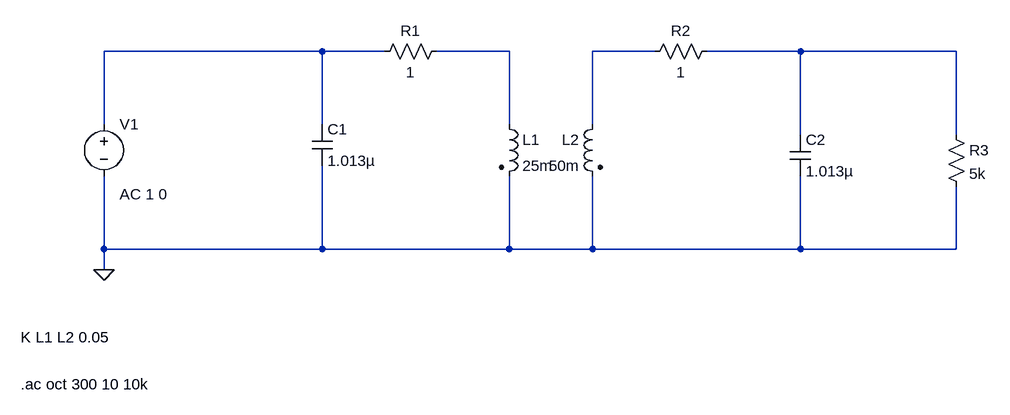
[diagram p0: schematic syncronous_freq.asc]
syncronous_freq.asc, the LTspice schematic file:
Version 4.1
SHEET 1 904 680
WIRE -128 16 -464 16
WIRE -32 16 -128 16
WIRE 160 16 48 16
WIRE 384 16 288 16
WIRE 608 16 464 16
WIRE 848 16 608 16
WIRE -464 128 -464 16
WIRE -128 128 -128 16
WIRE 160 128 160 16
WIRE 288 128 288 16
WIRE 608 144 608 16
WIRE 848 144 848 16
WIRE -464 320 -464 208
WIRE -128 320 -128 192
WIRE -128 320 -464 320
WIRE 160 320 160 208
WIRE 160 320 -128 320
WIRE 288 320 288 208
WIRE 288 320 160 320
WIRE 608 320 608 208
WIRE 608 320 288 320
WIRE 848 320 848 224
WIRE 848 320 608 320
WIRE -464 352 -464 320
FLAG -464 352 0
SYMBOL ind2 144 112 R0
SYMATTR InstName L1
SYMATTR Value 25m
SYMATTR SpiceLine Rser=0.01
SYMBOL ind2 304 112 M0
SYMATTR InstName L2
SYMATTR Value 50m
SYMATTR SpiceLine Rser=0.01
SYMBOL res 64 0 R90
WINDOW 0 0 56 VBottom 2
WINDOW 3 32 56 VTop 2
SYMATTR InstName R1
SYMATTR Value 1
SYMBOL res 480 0 R90
WINDOW 0 0 56 VBottom 2
WINDOW 3 32 56 VTop 2
SYMATTR InstName R2
SYMATTR Value 1
SYMBOL cap -144 128 R0
SYMATTR InstName C1
SYMATTR Value 1.013µ
SYMBOL cap 592 144 R0
SYMATTR InstName C2
SYMATTR Value 1.013µ
SYMBOL res 832 128 R0
SYMATTR InstName R3
SYMATTR Value 5k
SYMBOL voltage -464 112 R0
WINDOW 123 24 124 Left 2
WINDOW 39 0 0 Left 0
SYMATTR InstName V1
SYMATTR Value ""
SYMATTR Value2 AC 1 0
TEXT -592 456 Left 2 !K L1 L2 0.05
TEXT -592 528 Left 2 !.ac oct 300 10 10k

The netlist it stands for:
* syncronous_freq.asc
L1 N002 0 25m Rser=0.01
L2 N003 0 50m Rser=0.01
R1 N002 N001 1
R2 N004 N003 1
C1 N001 0 1.013µ
C2 N004 0 1.013µ
R3 N004 0 5k
V1 N001 0 AC 1 0
K L1 L2 0.05
.ac oct 300 10 10k
.backanno
.end